# Altium schematic sheet main_schematic.SchDoc
size A
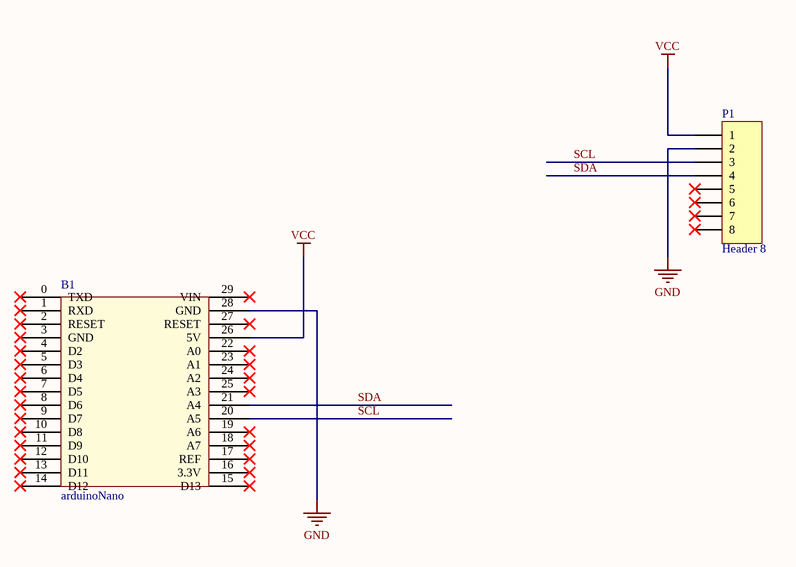
[diagram p0: main_schematic.SchDoc]

## Parts
B1  arduinoNano  [Arduino nano]
P1  Header 8  [HDR1X8]

## Nets
GND: B1.28(GND) P1.2
VCC: B1.26(5V) P1.1
SCL: B1.20(A5) P1.3
SDA: B1.21(A4) P1.4

Not connected (* = marked no-connect by the designer): B1 0(TXD)* 1(RXD)* 2(RESET)* 3(GND)* 4(D2)* 5(D3)* 6(D4)* 7(D5)* 8(D6)* 9(D7)* 10(D8)* 11(D9)* 12(D10)* 13(D11)* 14(D12)* 15(D13)* 16(3.3V)* 17(REF)* 18(A7)* 19(A6)* 22(A0)* 23(A1)* 24(A2)* 25(A3)* 27(RESET)* 29(VIN)*; P1 5* 6* 7* 8*

## Library data of the parts
P1 = Header 8: Header, 8-Pin; LatestRevisionDate: 17-Jul-2002; LatestRevisionNote: Re-released for DXP Platform.; Publisher: Altium Limited